# EAGLE design ovms_lilygo_tcall (EAGLE 9.6.2)
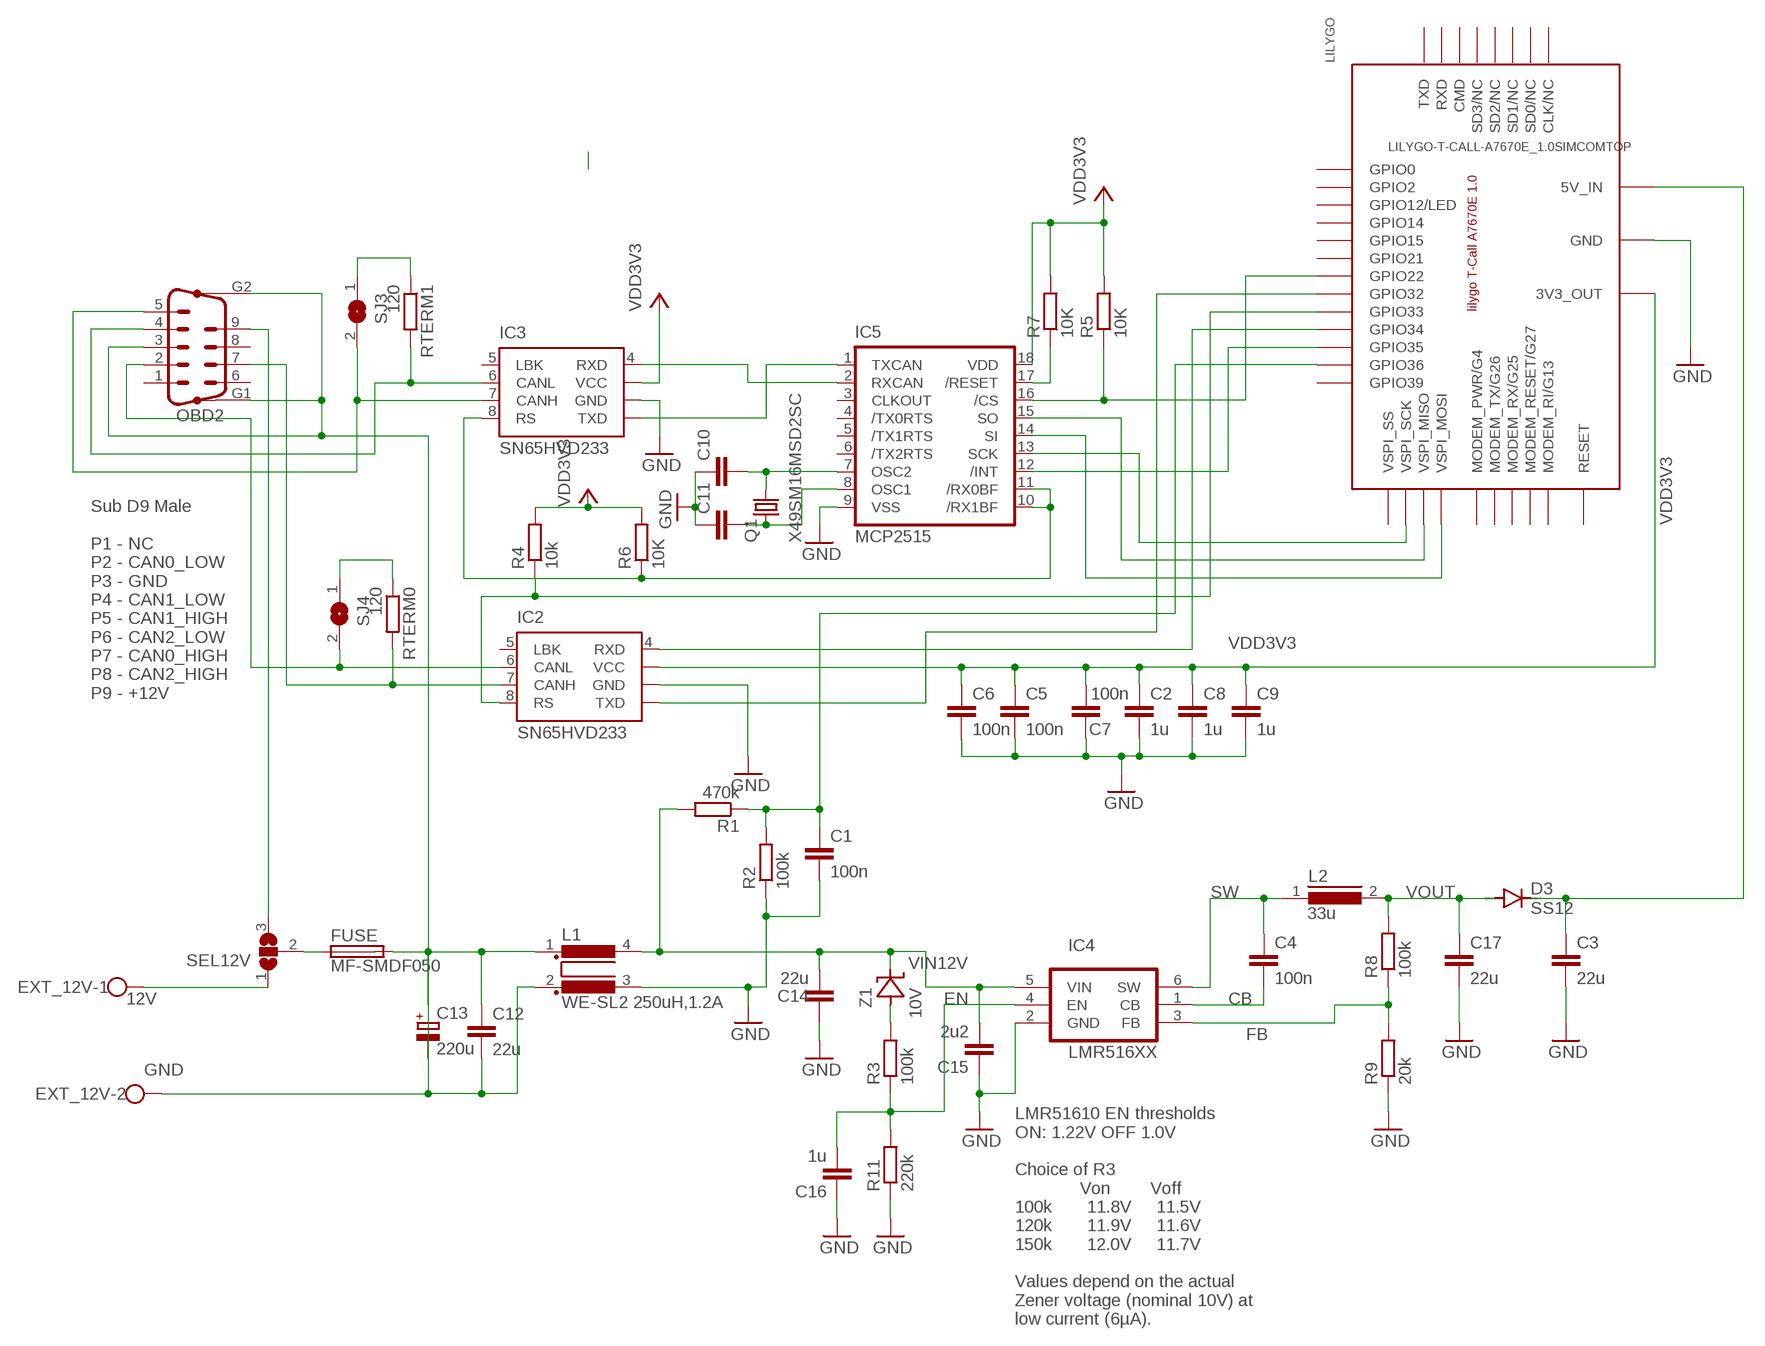
[diagram p0: schematic, sheet 1]

## Parts
C1  100n  C-EUC0805K  [C0805K]
C2  1u  C-EUC0805K  [C0805K]
C3  22u  C-EUC0805K  [C0805K]
C4  100n  C-EUC0805K  [C0805K]
C5  100n  C-EUC0805K  [C0805K]
C6  100n  C-EUC0805K  [C0805K]
C7  100n  C-EUC0805K  [C0805K]
C8  1u  C-EUC0805K  [C0805K]
C9  1u  C-EUC0805K  [C0805K]
C10  22pF  C-EUC0805K  [C0805K]
C11  22pF  C-EUC0805K  [C0805K]
C12  22u  C-EUC1206K  [C1206K]
C13  220u  CPOL-EUUD-8X10  [UD-8X10_NICHICON]
C14  22u  C-EUC1206K  [C1206K]
C15  2u2  C-EUC0805K  [C0805K]
C16  1u  C-EUC0805K  [C0805K]
C17  22u  C-EUC0805K  [C0805K]
D3  SS12  DIODE-SOD123  [SOD123]
EXT_12V  GND  W237-102  [W237-102]
FUSE  MF-SMDF050  [MF-SMDF050]
IC2  SN65HVD233  SN65HVD23XS  [SO-08]
IC3  SN65HVD233  SN65HVD23XS  [SO-08]
IC4  LMR516XX  [SOT23-6]
IC5  MCP2515  MCP2510S  [SO-18W]
L1  WE-SL2 250uH,1.2A  CM-CHOKE-SMD  [CHOKE_SMD]
L2  33u  DR74  [DR74]
LILYGO  LILYGO-T-CALL-A7670E_1.0SIMCOMTOP  [LILYGO-TCALL-A7670E_1.0]
OBD2  M09HP  [M09HP]
Q1  X49SM16MSD2SC  KX-KS  [11.4X4.5]
R1  470k  R-EU_M0805  [M0805]
R2  100k  R-EU_M0805  [M0805]
R3  100k  R-EU_M0805  [M0805]
R4  10k  R-EU_M0805  [M0805]
R5  10K  R-EU_M0805  [M0805]
R6  10K  R-EU_M0805  [M0805]
R7  10K  R-EU_M0805  [M0805]
R8  100k  R-EU_M0805  [M0805]
R9  20k  R-EU_M0805  [M0805]
R11  220k  R-EU_M0805  [M0805]
RTERM0  120  R-EU_M0805  [M0805]
RTERM1  120  R-EU_M0805  [M0805]
SEL12V  SJ2W  [SJ_2]
SJ3  SJ  [SJ]
SJ4  SJ  [SJ]
Z1  10V  ZENER-DIODE  [SOT23]

## Nets
12V: C12.1 C13.+ FUSE.2 L1.1
CB: C4.2 IC4.1(CB)
EN: C16.2 IC4.4(EN) R3.1 R11.2
EXT12V: EXT_12V.1 SEL12V.1
FB: IC4.3(FB) R8.1 R9.2
GND: C1.2 C2.2 C3.2 C5.2 C6.2 C7.1 C8.2 C9.2 C10.1 C11.1 C14.1 C15.1 C16.1 C17.2 IC2.2(GND) IC3.2(GND) IC4.2(GND) IC5.9(VSS) L1.3 LILYGO.1(GND) LILYGO.7(GND) LILYGO.25(GND) R2.1 R9.1 R11.1
GND1: C12.2 C13.- EXT_12V.2 L1.2 OBD2.3 OBD2.G1 OBD2.G2
N$1: IC3.1(TXD) IC5.1(TXCAN)
N$2: FUSE.1 SEL12V.2
N$3: IC3.4(RXD) IC5.2(RXCAN)
N$4: IC5.17(/RESET) R7.1
N$5: IC5.16(/CS) LILYGO.3(GPIO22) R5.1
N$6: IC3.8(RS) IC5.10(/RX1BF) IC5.11(/RX0BF) R6.1
N$7: C10.2 IC5.7(OSC2) Q1.2
N$8: R3.2 Z1.1(A)
N$9: IC2.4(RXD) LILYGO.34(GPIO34)
N$10: IC2.1(TXD) LILYGO.32(GPIO32)
N$11: IC2.6(CANL) OBD2.2 SJ4.2
N$15: IC2.8(RS) LILYGO.31(GPIO33) R4.1
N$16: IC2.7(CANH) OBD2.7 RTERM0.2
N$17: IC3.6(CANL) OBD2.4 RTERM1.2
N$18: IC3.7(CANH) OBD2.5 SJ3.2
N$21: C1.1 LILYGO.36(GPIO36) R1.1 R2.2
N$28: IC5.12(/INT) LILYGO.33(GPIO35)
N$30: C11.2 IC5.8(OSC1) Q1.1
N$32: IC5.13(SCK) LILYGO.9(VSPI_SCK)
N$33: IC5.15(SO) LILYGO.8(VSPI_MISO)
N$34: IC5.14(SI) LILYGO.2(VSPI_MOSI)
N$38: RTERM1.1 SJ3.1
N$39: RTERM0.1 SJ4.1
OBD12V: OBD2.9 SEL12V.3
SW: C4.1 IC4.6(SW) L2.1
VCC5V: C3.1 D3.C LILYGO.20(5V_IN)
VDD3V3: C2.1 C5.1 C6.1 C7.2 C8.1 C9.1 IC2.3(VCC) IC3.3(VCC) IC5.18(VDD) LILYGO.38(3V3_OUT) R4.2 R5.2 R6.2 R7.2
VIN12V: C14.2 C15.2 IC4.5(VIN) L1.4 R1.2 Z1.3(C)
VOUT: C17.1 D3.A L2.2 R8.2
Unconnected: IC2.5(LBK) IC3.5(LBK) IC5.3(CLKOUT) IC5.4(/TX0RTS) IC5.5(/TX1RTS) IC5.6(/TX2RTS) LILYGO.4(TXD) LILYGO.5(RXD) LILYGO.6(GPIO21) LILYGO.10(VSPI_SS) LILYGO.13(MODEM_PWR/G4) LILYGO.14(GPIO0) LILYGO.15(GPIO2) LILYGO.16(GPIO15) LILYGO.17(SD1/NC) LILYGO.18(SD0/NC) LILYGO.19(CLK/NC) LILYGO.21(CMD) LILYGO.22(SD3/NC) LILYGO.23(SD2/NC) LILYGO.24(MODEM_RI/G13) LILYGO.26(GPIO12/LED) LILYGO.27(GPIO14) LILYGO.28(MODEM_RESET/G27) LILYGO.29(MODEM_TX/G26) LILYGO.30(MODEM_RX/G25) LILYGO.35(GPIO39) LILYGO.37(RESET) OBD2.1 OBD2.6 OBD2.8

## Notes on the sheet
- Sub D9 Male
  
  P1 - NC
  P2 - CAN0_LOW
  P3 - GND
  P4 - CAN1_LOW
  P5 - CAN1_HIGH
  P6 - CAN2_LOW
  P7 - CAN0_HIGH
  P8 - CAN2_HIGH
  P9 - +12V
- LMR51610 EN thresholds
  ON: 1.22V OFF 1.0V
  
  Choice of R3
               Von        Voff
  100k       11.8V     11.5V
  120k       11.9V     11.6V
  150k       12.0V     11.7V
  
  Values depend on the actual 
  Zener voltage (nominal 10V) at 
  low current (6µA).

## Library data of the parts
C1-C12 C14-C17 = rcl:C-EU: CAPACITOR, European symbol; SPICEPREFIX: C
C13 = rcl:CPOL-EU: POLARIZED CAPACITOR, European symbol; SPICEPREFIX: C
D3 = diode:DIODE-: DIODE
EXT_12V = con-wago-500:W237-102: WAGO SCREW CLAMP; MPN: 237-102; OC_FARNELL: unknown; OC_NEWARK: 70K9898; VIN: 12V
FUSE = ovms_lilygo:MF-SMDF: MF-SMDF Series - PRC Resettable Fuses Source: http://www.farnell.com/datasheets/716597.pdf
IC2 IC3 = ovms_lilygo:SN65HVD23X
IC4 = ovms_lilygo:LMR516XX: Buck Converter LMR516XX
IC5 = microchip:MCP2510
L1 = ovms_lilygo:CM-CHOKE: Common mode choke MSD7342 (SMD); OC_FARNELL: unknown; OC_NEWARK: unknown
L2 = inductors:DR74: High Power Density, High Efficiency, Shielded Inductors Source: coiltronics_dr_series.pdf; SPICEPREFIX: L
LILYGO = ovms_lilygo:LILYGO-T-CALL-A7670E_1.0: Liliygo T-Call A7670E V1.0 Modul
OBD2 = con-subd:M09HP: SUB-D; OC_FARNELL: unknown; OC_NEWARK: unknown
Q1 = crystal-geyer_V1_0:KX: Quartz Crystals (MHz) SMD: KX - Serie Model Size l/w/h [mm] Frequency Range Frequency Stability Temp. Range [°C] Load Capacitance AECQ 200 availabel Datasheet KX-4 KX-5 KX-6 KX-7 KX-9A KX-9B KX-12A KX-12B KX-13 KX-20 KX-K KX-KS 1.6/1.2/0.3 2.0/1.6/0.45 2.5/2.0/0.55 3.2/2.5/0.8 5.0/3.2/1.0 5.0/3.2/1.1 6.0/3.5/1.1 6.0/3.5/1.0 7.0/5.0 /1.3 11.6/5.5/1.6 12.3/4.5/4.2 12.3/4.5/3.2 24.0 ~ 80.0 MHz 16.0 ~ 80.0 MHz 12.0 ~ 80.0 MHz 8.0 ~ 60.0 MHz 7,68 ~ 300,0 MHz 8,0 ~ 50,0 MHz 8,0 ~ 150,0 MHz 8,0 ~ 50,0 MHz 6,0 ~ 160,0 MHz 3,579 ~ 25,0 MHz 3,579 ~ 70,0 MHz 3,579 ~ 70,0 MHz ±10 … ±50ppm ±10 … ±50ppm ±10 … ±50ppm ±10 … ±50ppm ±10 … ±50ppm ±10 … ±50ppm ±10 … ±50ppm ±10 … ±50ppm ±10 … ±50ppm ±50ppm ±10 … ±50ppm ±10 … ±50ppm (*) -40°C …+85°C (*) -40°C …+125°C (*) -40°C …+125°C (*) -40°C …+125°C (*) -40°C …+105°C (*) -40°C …+105°C (*) -40°C …+125°C (*) -40°C …+105°C (*) -40°C …+105°C (*) -40°C …+105°C (*) -40°C …+85°C (*) -40°C …+85°C 8, 8…16 8, 8…16 10, 8…16 12, 7…20 16, 10…20 16, 10…20 16, 10…20 16, 12…20 16, 12…20 16, 12…20 16, 12…30 16, 12…30 - yes yes yes - - - - - - - - KX-4.pdf <http://www.geyer-electronic.de/uploads/tx_userartikelfrequenz/GEYER-KX-4.pdf> KX-5.pdf <http://www.geyer-electronic.de/uploads/tx_userartikelfrequenz/GEYER-KX-5.pdf> KX-6.pdf <http://www.geyer-electronic.de/uploads/tx_userartikelfrequenz/GEYER-KX-6.pdf> KX-7.pdf <http://www.geyer-electronic.de/uploads/tx_userartikelfrequenz/GEYER-KX-7.pdf> KX-9A.pdf <http://www.geyer-electronic.de/uploads/tx_userartikelfrequenz/GEYER-KX-9A.pdf> KX-9B.pdf <http://www.geyer-electronic.de/uploads/tx_userartikelfrequenz/GEYER-KX-9B.pdf> KX-12A.pdf <http://www.geyer-electronic.de/uploads/tx_userartikelfrequenz/GEYER-KX-12A.pdf> KX-12B.pdf <http://www.geyer-electronic.de/uploads/tx_userartikelfrequenz/GEYER-KX-12B.pdf> KX-13.pdf <http://www.geyer-electronic.de/uploads/tx_userartikelfrequenz/GEYER-KX-13.pdf> KX-20.pdf <http://www.geyer-electronic.de/uploads/tx_userartikelfrequenz/GEYER-KX-20.pdf> KX-K.pdf <http://www.geyer-electronic.de/uploads/tx_userartikelfrequenz/GEYER-KX-K.pdf> KX-KS.pdf <http://www.geyer-electronic.de/uploads/tx_userartikelfrequenz/GEYER-KX-KS.pdf> <http://www.geyer-electronic.de/fileadmin/template/img/logo-geyer-electronic.png> Details see: http://www.geyer-electronic.de/Frequenz-Produkte.9.0.html Created 2016-06-07, Hans Locher 2016 (C) Geyer Quartz Technology KX4,KX5,KX6,KX7,KX9A,KX9B,KX12A,KX12B,KX13,KX20,KXK,KXKS;1612;2016;2520;3225;5032;6035;7050;11655;12345;1,6x1,2;2,0x1,6;2,5x2,0;3,2x2,5;5,0x3,2;6,0x3,5;7,0x5,0;11,6x5,5;12,3x4,5;12,3x4,5;1.6x1.2;2.0x1.6;2.5x2.0;3.2x2.5;5.0x3.2;6.0x3.5;7.0x5.0;11.6x5.5;12.3x4.5;12.3x4.5;
R1-R9 R11 RTERM0 RTERM1 = rcl:R-EU_: RESISTOR, European symbol; SPICEPREFIX: R
SEL12V = jumper:SJ2W: SMD solder JUMPER
SJ3 SJ4 = jumper:SJ: SMD solder JUMPER
Z1 = ovms_lilygo:ZENER-DIODE: Zener Diode

## Board
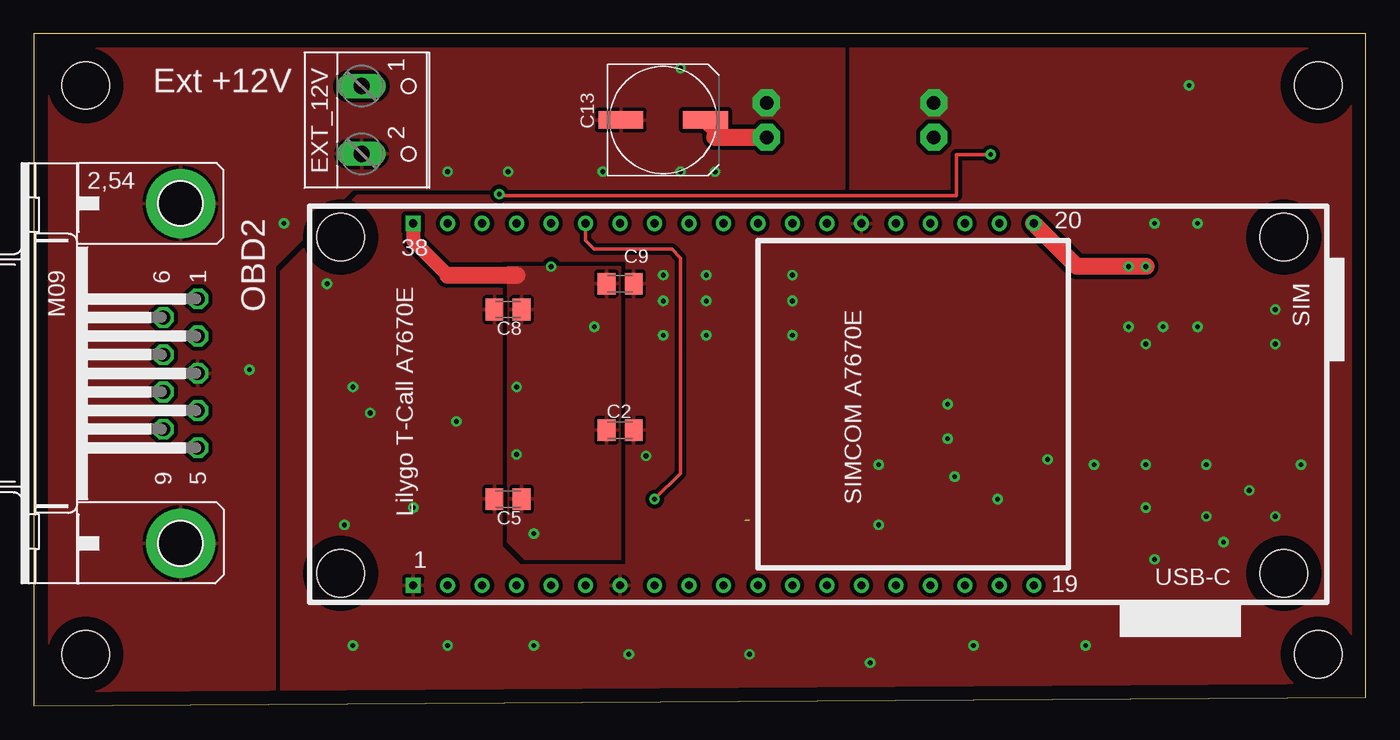
[diagram p1: board, top side]
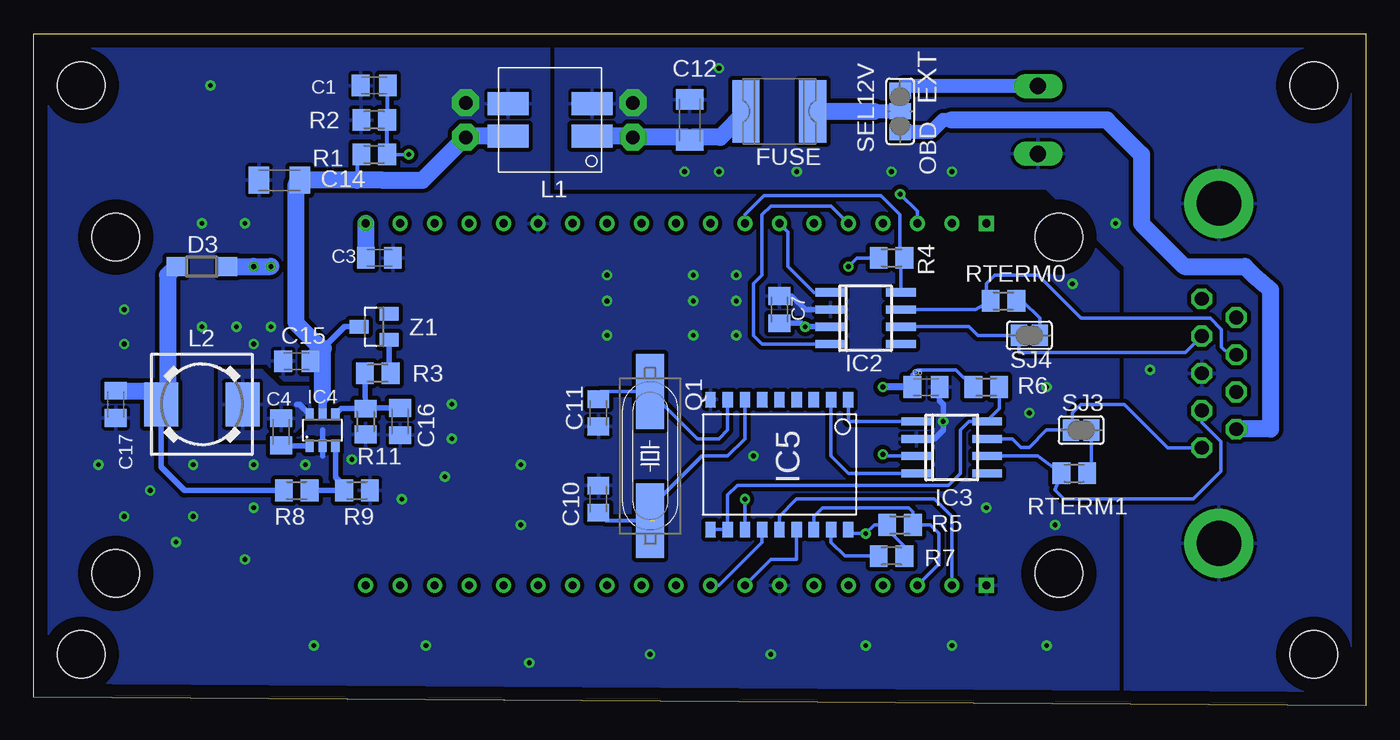
[diagram p2: board, bottom side, seen from below]

Size 98.09 x 49.52 mm. Coordinates in mm from the lower left corner, seen from the top.
Outline: 0,0 98.09,0.64 98.09,49.52 0,49.52 0,0
Copper layers (1*16): Top 0.035mm / dielectric 1.5mm / Bottom 0.035mm
Design rules "default *": minimum track width 6mil, minimum drill 0.35mm, track to track 12mil, track to pad 12mil, pad to pad 12mil, via to via 10mil, smd to smd 12mil, copper to edge 40mil, drill to drill 6mil, minimum pad ring 10mil, minimum via ring 8mil, stop-mask expansion 4mil, vias tented up to drill 0mil, thermal gap 10mil
Holes 3.5 mm at 94.61,45.72 94.61,3.81 3.81,3.81 3.81,45.72

### Footprints (pad centres in the part's own frame; a part is rotated, then mirrored left to right if it is on the bottom)
C0805K = smd 1.3 x 1.6: 1 -1,0; 2 1,0
C1206K = smd 1.5 x 2: 1 -1.5,0; 2 1.5,0
UD-8X10_NICHICON = smd 3.3 x 1.3: + 3.125,0; - -3.125,0
SOD123 = smd 1.4 x 1.4: A 1.9,0; C -1.9,0
W237-102 = drill 1.194 long: 1 -2.5,-1.27; 2 2.5,-1.27
MF-SMDF050 = smd 2 x 4.6: 1 -2.45,0; 2 2.45,0
SO-08 = smd 0.6 x 2.2: 1 -1.905,-2.6; 2 -0.635,-2.6; 3 0.635,-2.6; 4 1.905,-2.6; 5 1.905,2.6; 6 0.635,2.6; 7 -0.635,2.6; 8 -1.905,2.6
SOT23-6 = smd 0.6 x 0.9: 1 -0.95,-1.15; 2 0,-1.15; 3 0.95,-1.15; 4 0.95,1.15; 5 0,1.15; 6 -0.95,1.15
SO-18W = smd 0.762 x 1.143: 1 -5.08,-4.788; 2 -3.81,-4.788; 3 -2.54,-4.788; 4 -1.27,-4.788; 5 0,-4.788; 6 1.27,-4.788; 7 2.54,-4.788; 8 3.81,-4.788; 9 5.08,-4.788; 10 5.08,4.788; 11 3.81,4.788; 12 2.54,4.788; 13 1.27,4.788; 14 0,4.788; 15 -1.27,4.788; 16 -2.54,4.788; 17 -3.81,4.788; 18 -5.08,4.788
CHOKE_SMD = smd 1.7 x 3: 1 1.198,-0.72; 2 -1.198,-0.72; 3 -1.198,-6.9; 4 1.198,-6.9
DR74 = smd 2.5 x 3.25: 1 -3,0; 2 3,0
LILYGO-TCALL-A7670E_1.0 = drill 0.6 square: 1 -29.21,-13.97; 38 -29.21,12.7 | drill 0.6: 2 -26.67,-13.97; 3 -24.13,-13.97; 4 -21.59,-13.97; 5 -19.05,-13.97; 6 -16.51,-13.97; 7 -13.97,-13.97; 8 -11.43,-13.97; 9 -8.89,-13.97; 10 -6.35,-13.97; 11 -3.81,-13.97; 12 -1.27,-13.97; 13 1.27,-13.97; 14 3.81,-13.97; 15 6.35,-13.97; 16 8.89,-13.97; 17 11.43,-13.97; 18 13.97,-13.97; 19 16.51,-13.97; 20 16.51,12.7; 21 13.97,12.7; 22 11.43,12.7; 23 8.89,12.7; 24 6.35,12.7; 25 3.81,12.7; 26 1.27,12.7; 27 -1.27,12.7; 28 -3.81,12.7; 29 -6.35,12.7; 30 -8.89,12.7; 31 -11.43,12.7; 32 -13.97,12.7; 33 -16.51,12.7; 34 -19.05,12.7; 35 -21.59,12.7; 36 -24.13,12.7; 37 -26.67,12.7 | hole 3.5: -34.544,11.684; -34.544,-13.081; 34.925,-13.081; 34.925,11.684
M09HP = drill 1.016 octagon: 1 -5.486,1.27; 2 -2.743,1.27; 3 0,1.27; 4 2.743,1.27; 5 5.486,1.27; 6 -4.115,-1.27; 7 -1.372,-1.27; 8 1.372,-1.27; 9 4.115,-1.27 | drill 3.302 pad 5.08: G1 -12.522,0; G2 12.522,0
11.4X4.5 = smd 5.5 x 2.08: 1 -4.75,0; 2 4.75,0
M0805 = smd 1.3 x 1.6: 1 -0.95,0; 2 0.95,0
SJ_2 = smd 1.168 x 1.6: 1 -1.524,0; 2 0,0; 3 1.524,0
SJ = smd 1.168 x 1.6: 1 -0.762,0; 2 0.762,0
SOT23 = smd 1 x 1.4: 1 -0.95,-1.1; 2 0.95,-1.1; 3 0,1.1

### Placement (x,y rotation side)
C1  73.03,45.72 180 bottom
C2  43.18,20.32 0 top
C3  72.64,33.02 0 bottom
C4  79.88,20.19 270 bottom
C5  34.92,15.24 180 top
C6  32.38,23.5 0 bottom
C7  43.18,29.21 270 bottom
C8  34.92,29.21 180 top
C9  43.18,31.11 0 top
C10  56.52,15.24 270 bottom
C11  56.52,21.59 90 bottom
C12  49.78,43.18 90 bottom
C13  46.35,43.18 0 top
C14  80.01,38.73 0 bottom
C15  78.74,25.4 0 bottom
C16  71.12,20.95 90 bottom
C17  92.08,22.23 270 bottom
D3  85.72,32.38 180 bottom
EXT_12V  25.4,43.18 270 top
FUSE  43.18,43.81 180 bottom
IC2  36.83,28.57 270 bottom
IC3  30.48,19.05 270 bottom
IC4  76.83,20.32 0 bottom
IC5  43.18,17.78 180 bottom
L1  56.26,43.18 270 bottom
L2  85.72,22.23 180 bottom
LILYGO  57.15,22.86 0 top
OBD2  10.79,24.51 270 top
Q1  52.7,18.41 270 bottom
R1  73.03,40.64 180 bottom
R2  73.03,43.18 0 bottom
R3  220k  [M0805]  72.77,24.51 0 bottom
R4  34.92,33.02 180 bottom
R5  34.29,13.34 180 bottom
R6  27.94,23.5 180 bottom
R7  34.92,11.05 0 bottom
R8  78.74,15.88 180 bottom
R9  74.3,15.88 180 bottom
R11  470k  [M0805]  73.66,20.95 90 bottom
RTERM0  26.67,29.84 180 bottom
RTERM1  21.46,17.14 180 bottom
SEL12V  34.29,43.81 270 bottom
SJ3  20.95,20.32 180 bottom
SJ4  24.77,27.3 180 bottom
Z1  73.03,27.94 90 bottom

### Tracks (layer width: path | path; a pad name or v marks a point on that pad's centre or on a via)
12V  (via drill 1 pad 2)
  Top 1.27: C13.+ 50.16,42.49 50.16,41.91 v53.98,41.91
  Bottom 1.27: FUSE.2 47.53,41.91 49.65,41.91 C12.1 49.91,41.91 v53.98,41.91 54.05,41.98 L1.1
CB
  Bottom 0.406: IC4.1 79.86,19.17 C4.2
EN
  Bottom 0.406: 73.61,21.95 R11.2 75.45,21.91 IC4.4 | 73.61,21.95 C16.2 | R3.1 73.66,22 73.61,21.95
EXT12V
  Bottom 1.016: EXT_12V.1 33.95,45.68 SEL12V.1
  Bottom 1.27: EXT_12V.1 24.17,45.72
FB
  Bottom 0.406: R8.1 R9.2 74.93,15.88 75.89,16.83 IC4.3
GND  (via drill 0.35, 1 pad 2)
  Bottom 0.406: IC2.2 41.27,29.21 42.27,30.21 C7.1 | C6.2 31.39,22.5 31.11,22.23 31.11,20.32 31.75,19.68 IC3.2 | 76.83,18.41 IC4.2 76.83,20.32
  other vias: 23.5,4.45 30.48,4.45 36.83,4.45 43.81,3.81 52.7,3.81 61.59,3.17 69.22,4.45 77.47,4.45 22.86,13.34 21.59,31.11 62.23,17.78 45.09,18.41 62.23,13.34 82.55,10.79 87.63,12.06 83.19,27.94 85.09,45.72 31.11,20.95 66.29,44.45 23.5,23.5 24.77,21.59 27.94,14.61 46.35,31.75 46.35,29.84 46.35,27.3 49.53,31.75 49.53,29.84 49.53,27.3 55.88,31.75 55.88,29.84 55.88,27.3 81.92,17.78 81.92,26.67 78.11,17.78 86.36,17.78 74.68,18.16 70.99,15.24 67.82,16.89 67.31,19.68 67.31,22.23 85.72,27.94 82.55,35.56 80.64,27.94 85.72,35.56 86.36,13.97 81.92,14.61 93.34,17.78 89.53,15.88 91.44,13.97 91.44,26.67 91.44,29.21
  pour Top (rank 2): 0.64,49.53 97.79,49.53 97.79,0.64 0,0.64 0,48.9
  pour Bottom (rank 2): 0.64,49.53 0.64,0.64 97.79,0.64 97.79,49.53
GND1  (via drill 0.35, 1 pad 2)
  other vias: 15.88,24.77 18.41,35.56 47.62,46.99 47.62,39.37 50.16,39.37 41.91,39.37 34.92,39.37 30.48,39.37 53.98,44.45
  pour Top (isolate 0.254): 0.64,49.53 0.64,0.64 17.78,0.64 17.78,32.38 23.5,38.1 59.69,38.1 59.69,49.53
  pour Bottom: 0.64,0.64 17.78,0.64 17.78,32.38 23.5,38.1 59.69,38.1 59.69,49.53 1.27,49.53 0.64,48.9
N$1
  Bottom 0.254: IC3.1 38.1,20.95 IC5.1
N$2
  Bottom 1.016: 36.19,43.81 SEL12V.2
  Bottom 1.27: FUSE.1 36.19,43.81
N$3
  Bottom 0.254: IC3.4 38.1,17.14 39.37,18.41 IC5.2
N$4
  Bottom 0.254: 35.56,11.36 R7.1 38.35,11.05 39.37,12.06 IC5.17
N$5
  Bottom 0.254: IC5.16 40.64,13.97 40.01,14.61 33.66,14.61 33.34,14.29 R5.1 32.07,13.34 31.43,12.7 31.43,10.47 LILYGO.3
N$6
  Bottom 0.254: IC5.10 IC5.11 46.99,15.53 46.27,16.26 30.73,16.26 29.84,17.14 29.84,20.32 29.21,20.95 27.94,20.95 | IC3.8 27.94,20.95 | R6.1 26.99,21.91 27.94,20.95
N$7  (1 unrouted)
  Bottom 0.152: 52.38,13.66 52.07,13.97
  Bottom 0.254: IC5.7 45.72,19.68 46.99,18.41 48.9,18.41
  Bottom 0.305: 56.12,13.84 C10.2 55.94,13.66 Q1.2 52.7,14.61 48.9,18.41
N$8
  Bottom 0.406: Z1.1 71.92,24.61 R3.2
N$9
  Bottom 0.254: IC2.4 44.45,26.67 45.09,27.3 45.09,31.11 44.45,31.75 44.45,36.2 43.81,36.83 39.37,36.83 LILYGO.34
N$10
  Bottom 0.254: IC2.1 40.64,30.48 42.55,32.38 42.55,34.92 LILYGO.32
N$11
  Bottom 0.254: SJ4.2 28.57,27.3 29.21,27.94 IC2.6 | SJ4.2 25.4,27.18 | SJ4.2 25.53,26.04 13.28,26.04 OBD2.2
N$15
  Bottom 0.254: IC2.8 34.23,32.77 R4.1 33.98,33.34 34.29,33.66 34.29,36.2 35.69,37.59 44.32,37.59 45.72,36.2 LILYGO.31
N$16
  Bottom 0.254: IC2.7 28.73,29.21 RTERM0.2 27.94,30 27.94,31.11 27.3,31.75 24.13,31.75 20.95,28.57 11.44,28.57 10.62,27.75 10.62,26.47 10.03,25.88 OBD2.7
N$17
  Bottom 0.254: IC3.6 24.16,18.41 RTERM1.2 22.89,15.9 22.23,15.24 12.7,15.24 10.67,17.27 10.67,19.48 12.06,20.88 OBD2.4
N$18
  Bottom 0.254: SJ3.2 23.5,20.32 24.77,19.05 25.4,19.05 26.04,19.68 IC3.7 | SJ3.2 21.21,19.81 | SJ3.2 21.59,20.45 21.59,21.59 20.95,22.23 17.78,22.23 14.58,19.02 OBD2.5
N$21  (via drill 0.35)
  Top 0.254: v70.48,40.64 67.94,40.64 67.94,37.59 34.42,37.59 v34.29,37.72
  Bottom 0.254: v70.48,40.64 R1.1 | v34.29,37.72 33.02,36.45 LILYGO.36
  Bottom 0.305: R1.1 R2.2 72.03,43.23 C1.1
N$28  (via drill 0.35)
  Top 0.254: LILYGO.33 40.64,34.29 41.27,33.66 46.99,33.66 47.62,33.02 47.62,17.14 v45.72,15.24
  Bottom 0.254: 45.72,12.7 IC5.12 v45.72,15.24
N$30
  Bottom 0.254: IC5.8 46.99,20.32 47.62,19.68 49.23,19.68 Q1.1 56.34,23.16 C11.2
N$32
  Bottom 0.254: IC5.13 44.45,12.06 47.62,8.89 LILYGO.9
N$33
  Bottom 0.254: IC5.15 41.91,10.79 43.81,10.79 LILYGO.8
N$34
  Bottom 0.254: IC5.14 43.18,13.97 41.91,15.24 31.75,15.24 30.48,13.97 LILYGO.2
N$38
  Bottom 0.254: SJ3.1 20.19,17.3 RTERM1.1
N$39
  Bottom 0.254: RTERM0.1 25.27,29.84 24,28.57 SJ4.1
OBD12V
  Bottom 1.016: 30.5,43.17 31.12,43.17 32,42.29 SEL12V.3
  Bottom 1.27: OBD2.9 6.99,20.4 6.99,30.65 8.26,31.75 8.89,32.38 13.34,32.38 16.51,35.56 16.51,40.64 19.04,43.17 30.5,43.17
SW
  Bottom 0.406: IC4.6 78.54,22.23 78.74,22.23
  pour Bottom: 77.47,23.5 77.47,21.59 79.38,19.68 84.45,19.68 84.45,24.77 81.28,24.77 80.01,23.5
VCC5V  (via drill 0.35)
  Top 1.27: v81.92,32.38 76.83,32.38 LILYGO.20
  Bottom 1.27: LILYGO.20 C3.1 | D3.C v81.92,32.38 v80.64,32.38
VDD3V3  (via drill 0.35)
  Top 1.016: LILYGO.38 27.94,34.29 30.48,31.75
  Top 1.27: 30.48,31.75 35.56,31.75
  Bottom 0.254: IC3.3 35.44,18.41 v35.56,18.54 | R4.2 37.47,33.02 v38.1,32.38 | R5.2 35.56,13.34 | 35.56,13.34 36.2,13.34 v36.83,12.7 37.81,12.7 IC5.18 | R7.2 33.98,11.75 35.56,13.34 | R6.2 30.16,24.77 33.02,24.77 33.38,24.4
  Bottom 0.305: 33.38,24.4 C6.1
  Bottom 0.406: IC2.3 v41.27,27.94 41.55,28.21 C7.2
  Bottom 0.508: C6.1 v35.56,23.5
  pour Top: 43.18,32.38 43.18,10.79 36.2,10.79 34.92,12.06 34.92,32.38
VIN12V  (via drill 1 pad 2)
  Bottom 0.305: R1.2 74.3,40.32 74.3,38.73
  Bottom 0.406: Z1.3 75.2,27.94 C15.2
  Bottom 0.508: 72.08,39.05 72.39,38.73
  Bottom 0.61: 76.83,22.86 IC4.5
  Bottom 1.27: 76.86,26.28 C15.2 76.79,26.35 | 76.86,26.28 76.86,22.89 76.83,22.86 | 76.86,26.28 78.77,28.18 78.77,38.48 C14.2 74.3,38.73 72.39,38.73 69.47,38.73 v66.29,41.91 66.22,41.98 L1.4
VOUT
  Bottom 0.406: 80.01,15.55 R8.2 87,15.88 88.72,17.61 L2.2
  Bottom 1.27: 88.09,23.11 88.09,22.86 88.26,22.69 | D3.A 88.26,31.75 88.26,22.69 | 88.26,22.69 L2.2 | C17.1 88.8,23.23 88.26,22.69

### Text on the board
tNames: Ext +12V
bNames: EXT | OBD
tCream: Car-Monitor V1.1 / CZ 01-2025